# EasyEDA schematic SCH_gaussian_cheap_2025-03-23.json
TITLE: Sheet_1; REV: 1.0; Date: 2025-03-22; Sheet: 1/1; Drawn By: aminesa0429; Company: Your Company
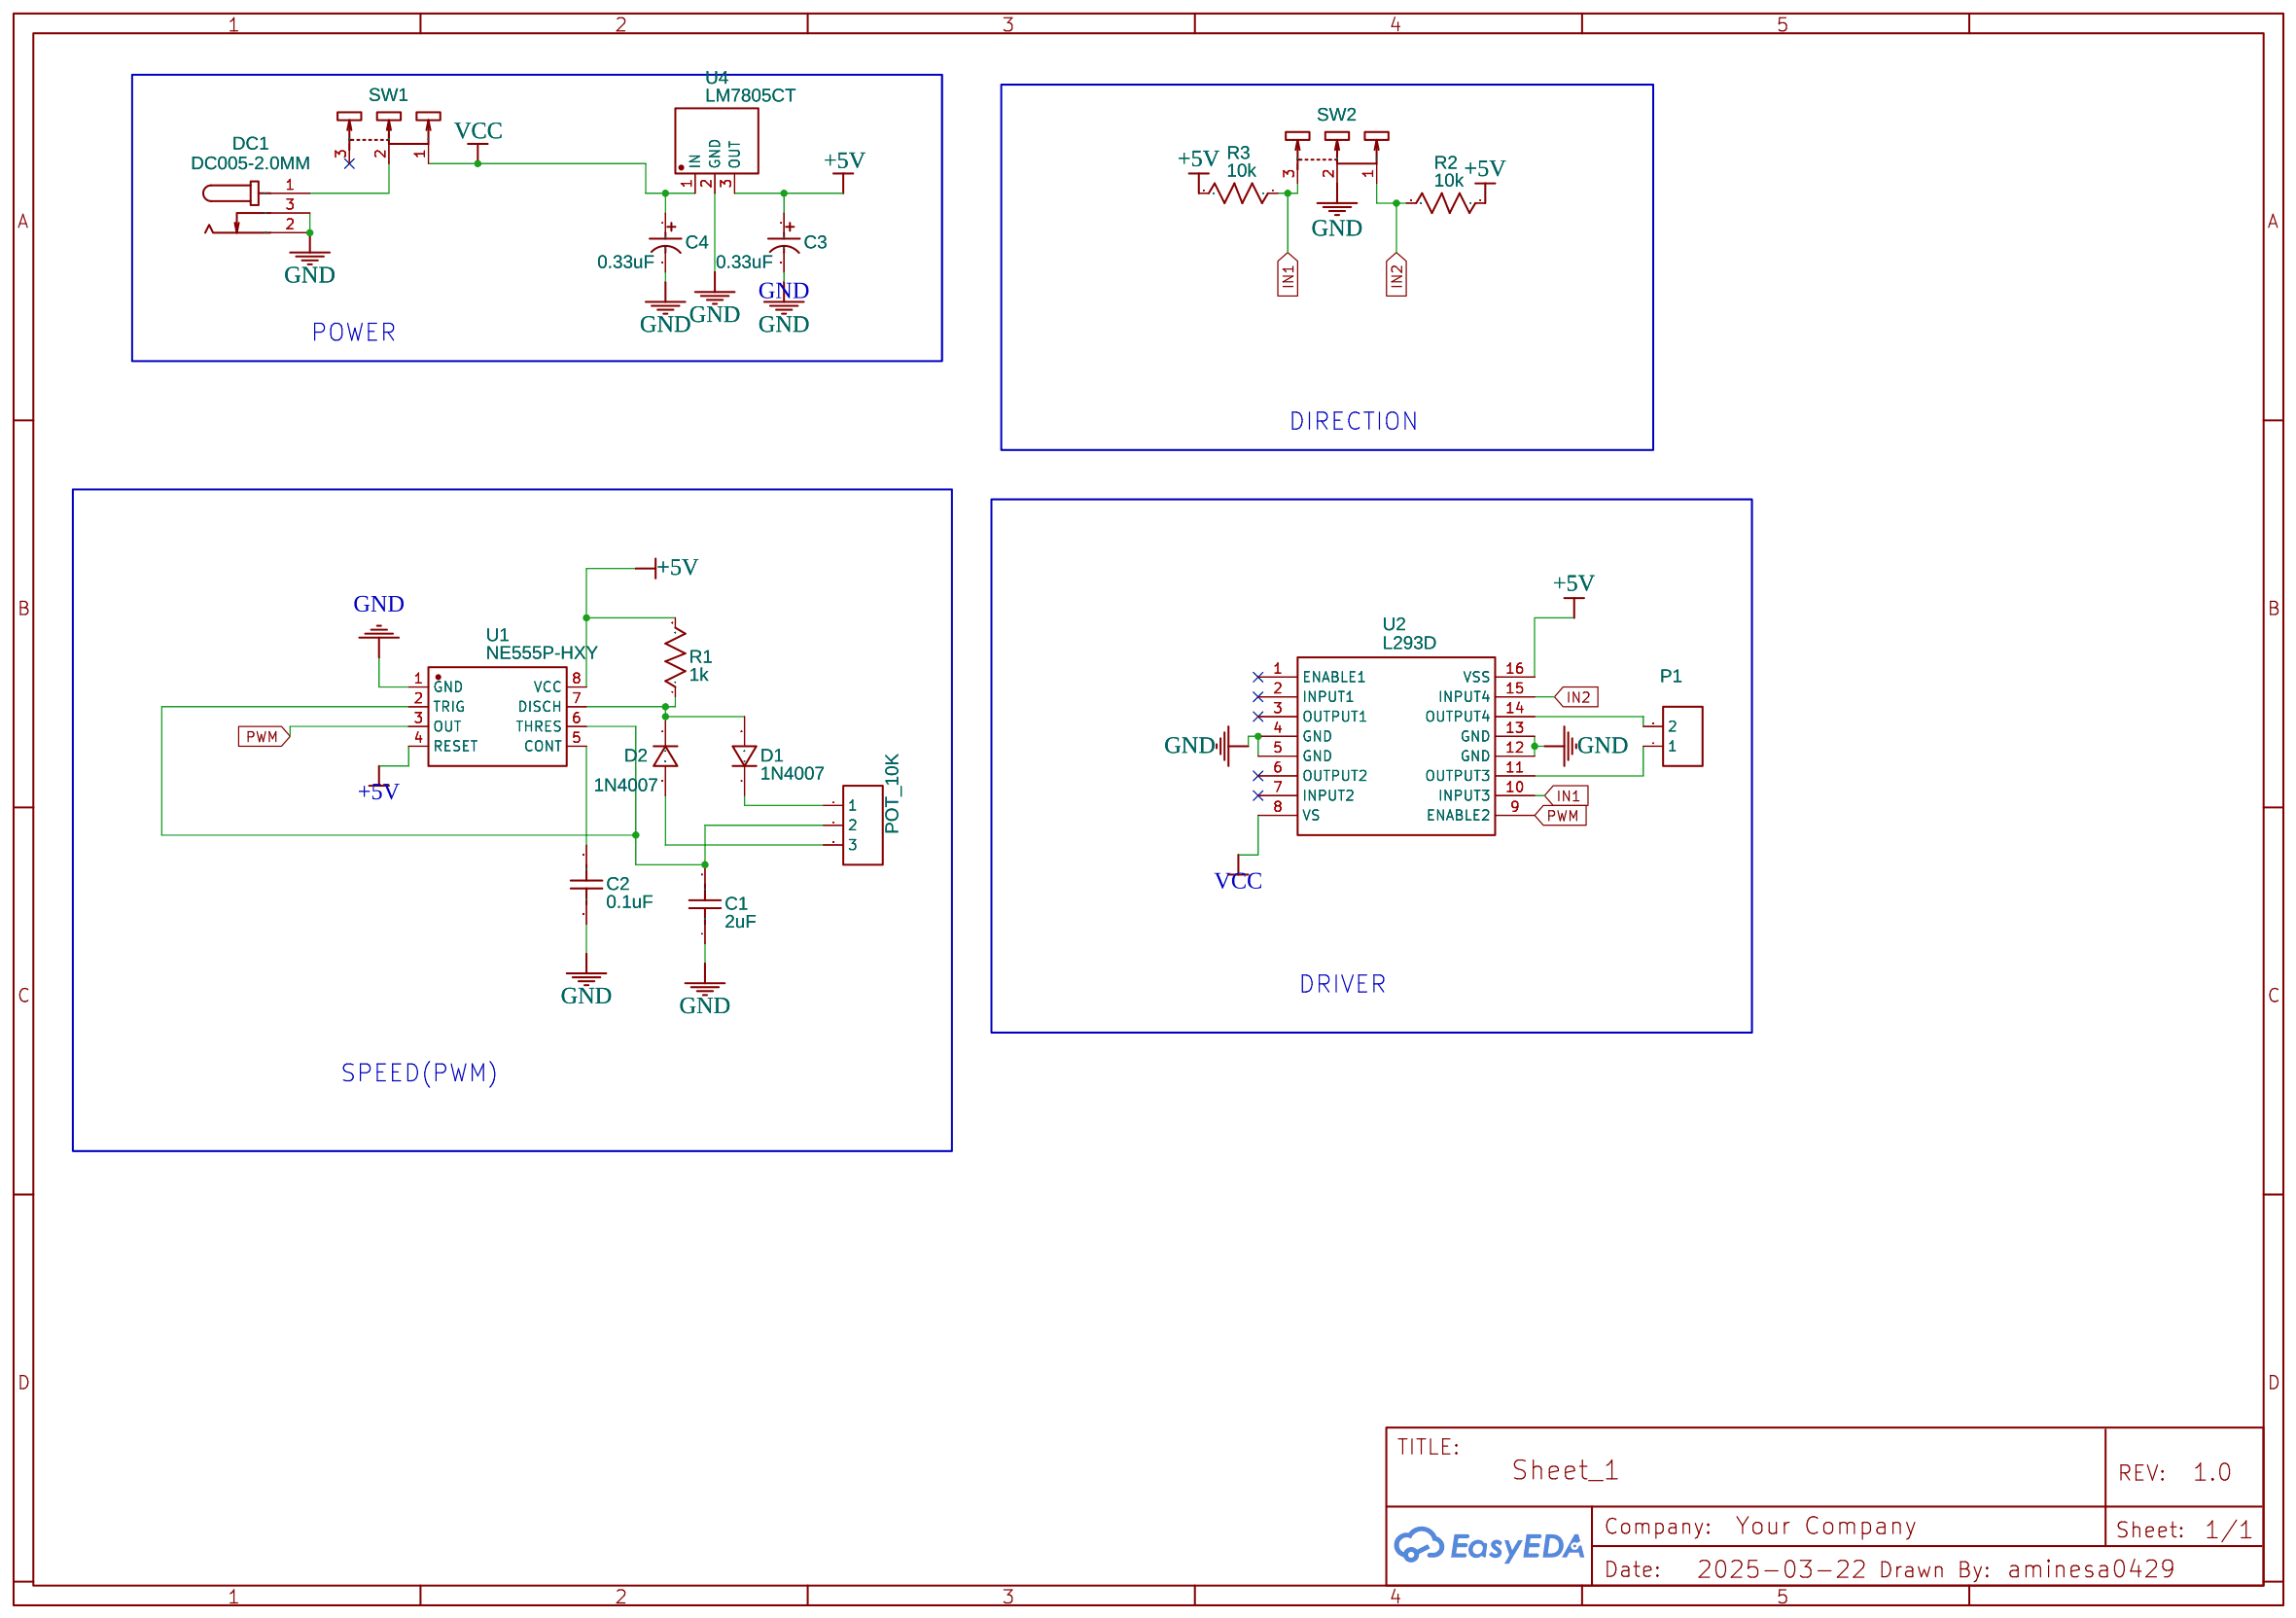
[diagram p0: schematic sheet]

## Parts
C1  2uF  [RAD-0.1]
C2  0.1uF  [RAD-0.1]
C3  0.33uF  [CAP-TH_BD5.0-P2.00-D0.8-FD]
C4  0.33uF  [CAP-TH_BD5.0-P2.00-D0.8-FD]
D1  1N4007  [DO-41_BD2.4-L4.7-P8.70-D0.9-RD]
D2  1N4007  [DO-41_BD2.4-L4.7-P8.70-D0.9-RD]
DC1  DC005-2.0MM  [DC-IN-TH_DC005]
P1  CONN-TH_2P-P5.08  [CONN-TH_2P-P5.08]
POT_10K  HDR-M-2.54_1x3  [HDR-M-2.54_1X3]
R1  1k  [R_AXIAL-0.5]
R2  10k  [R_AXIAL-0.5]
R3  10k  [R_AXIAL-0.5]
SW1  SLIDE-SWITCH-SPDT-125V-3A-4.7MM-180DEGR  [SLIDE-SWITCH-SPDT-125V-3A-4.7MM-180DEGR-FP]
SW2  SLIDE-SWITCH-SPDT-125V-3A-4.7MM-180DEGR  [SLIDE-SWITCH-SPDT-125V-3A-4.7MM-180DEGR-FP]
U1  NE555P-HXY  [PDIP-8_L9.6-W6.4-P2.54-LS7.6-BL]
U2  L293D  [DIP-16_L20.0-W6.4-P2.54-LS7.6-BL]
U4  LM7805CT  [TO-220-3_L10.0-W4.5-P2.54-L]

## Library data of the parts
C1 C2 = C_RAD-0.1_US: Contributor: LCEDA_Lib
C3 C4 = 0.33uF 50V 5*11: Supplier: LCSC; Manufacturer: ValuePro; Supplier Part: C45097; JLCPCB Part Class: Extended Part
D1 D2 = 1N4007: Supplier: LCSC; Manufacturer: SEMTECH; Supplier Part: C106903; Contributor: LCEDA_Lib
DC1 = DC005-2.0MM: Supplier: LCSC; Manufacturer: SOFNG; Supplier Part: C111567
P1 = CONN-TH_2P-P5.08: Supplier: LCSC; Contributor: LCEDA_Lib
POT_10K = HDR-M-2.54_1x3: Supplier Part: C180248; Supplier: LCSC; Contributor: LCEDA_Lib
R1-R3 = R_AXIAL-0.5_US: Contributor: LCEDA_Lib
SW1 SW2 = SLIDE-SWITCH-SPDT-125V-3A-4.7MM-180DEGR: Contributor: LCSC; Supplier: LCSC; Supplier Part: C319013; Manufacturer: XKB Connectivity(中国星坤); Manufacturer Part: SS-12D10L3; JLCPCB Part Class: Extended Part
U1 = NE555P-HXY: Supplier: LCSC; Supplier Part: C20616346; Manufacturer: HXY MOSFET(华轩阳电子); JLCPCB Part Class: Extended Part; Contributor: lcsc
U2 = L293D: Contributor: pitreluc; Supplier: LCSC; Manufacturer: ST(意法半导体); Supplier Part: C12340; JLCPCB Part Class: Extended Part; link: https://lcsc.com/eda_search?q=C12340&%26type=1&ref=editor
U4 = LM7805CT: Supplier: LCSC; Manufacturer: FAIRCHILD; Supplier Part: C22146; JLCPCB Part Class: Extended Part

## Nets
+5V: C3.1 R1.2 R2.1 R3.2 U1.4(RESET) U1.8(VCC) U2.16(VSS) U4.3(OUT)
GND: C1.1 C2.1 C3.2 C4.2 DC1.2 DC1.3 SW2.2 U1.1(GND) U2.4(GND) U2.5(GND) U2.12(GND) U2.13(GND) U4.2(GND)
VCC: C4.1 SW1.1 U2.8(VS) U4.1(IN)
IN1: R3.1 SW2.3 U2.10(INPUT3)
IN2: R2.2 SW2.1 U2.15(INPUT4)
PWM: U1.3(OUT) U2.9(ENABLE2)
Net-(C1-2): C1.2 POT_10K.2 U1.2(TRIG) U1.6(THRES)
Net-(C2-2): C2.2 U1.5(CONT)
Net-(D1-1): D1.1 POT_10K.1
Net-(D1-2): D1.2 D2.1 R1.1 U1.7(DISCH)
Net-(D2-2): D2.2 POT_10K.3
Net-(DC1-1): DC1.1 SW1.2
Net-(P1-1): P1.1 U2.11(OUTPUT3)
Net-(P1-2): P1.2 U2.14(OUTPUT4)

Not connected (* = marked no-connect by the designer): SW1 3*; U2 1(ENABLE1)* 2(INPUT1)* 3(OUTPUT1)* 6(OUTPUT2)* 7(INPUT2)*

## Notes on the sheet
- GND
- POWER
- DIRECTION
- DRIVER
- SPEED(PWM)
